# Altium project PCB_DONGHO-_LED_Nguyen_Tuan_Phong.PrjPcb
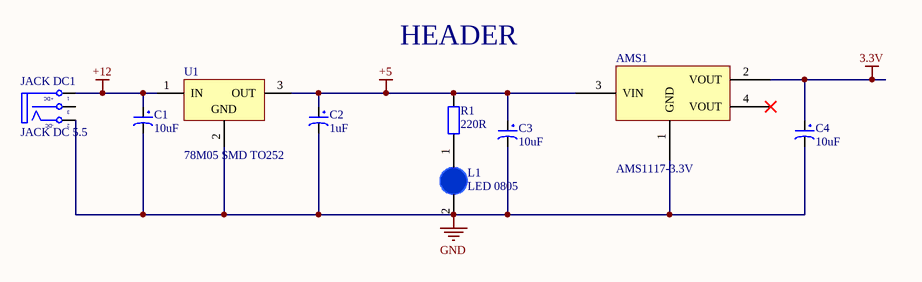
[diagram p0: HEADRE.SchDoc]
5 sheets, 70 parts. Net scope: flat (ports and power ports of the same name join across sheets).
Board file: PCB_DONGHO.PcbDoc
Sheets:
  HEADRE.SchDoc
  ESP8266.SchDoc
  LED 7 THANH.SchDoc
  DS3231.SchDoc
  SCH_DONGHO.SchDoc

## Sheet HEADRE.SchDoc
size A3; SheetNumber: 1; SheetTotal: 5

### Parts
AMS1  AMS1117-3.3V  [SOT223]
C1  10uF  [tu tantalum smd3216]
C2  1uF  [tu tantalum smd3216]
C3  10uF  [tu tantalum smd3216]
C4  10uF  [tu tantalum smd3216]
JACK_DC1  JACK DC 5.5  [JACK DC 5.5]
L1  LED 0805  [LED-0805-Blue]
R1  220R  [tro smd 0603]
U1  78M05 SMD TO252  [TO252]

### Nets
3.3V: AMS1.2(VOUT) C4.1
+5: AMS1.3(VIN) C2.1 C3.1 R1.2 U1.3(OUT)
+12: C1.1 JACK_DC1.1(T) U1.1(IN)
GND: AMS1.1(GND) C1.2 C2.2 C3.2 C4.2 JACK_DC1.2(TN) L1.2(K) U1.2(GND)
NetL1_1: L1.1(A) R1.1

Not connected (* = marked no-connect by the designer): AMS1 4(VOUT)*; JACK_DC1 3(S)

### Notes on the sheet
- HEADER
- (in symbol JACK DC 5.5) +DC; -DC

### Library data of the parts
AMS1 = AMS1117 SMD: Dán; Value: AMS1117-3.3V SOT223; Don_Vi: Con; Ma_Hang: MH000596; Ghi_Chu: *; Kieu_Chan: *; Chung_Loai: Dán
C1 C3 C4 = Tu tantalum 10uF 16V SMD3216: Dán; Don_Vi: Con; So_Chan: 2; Ten_Linh_Kien: Tụ tantalum 106C-10uF 16V SMD3216; Ma_Hang: MH001954; Chung_Loai: Dán; Kieu_Chan: *
C2 = Tu tantalum 1uF 25V SMD3216: Dán; Don_Vi: Con; So_Chan: 2; Ten_Linh_Kien: Tụ tantalum 105E-1uF 25V SMD3216; Ma_Hang: MH007472; Chung_Loai: Dán; Kieu_Chan: *
JACK_DC1 = JACK DC 5.5: Value: Jac DC
L1 = LED 0805 Xanh Duong: Dán; Don_Vi: Con; Ma_Hang: MH002327; Ten_Linh_Kien: LED 0805 Màu Xanh Dương (Blue); Ghi_Chu: *; Kieu_Chan: *; Chung_Loai: Dán
R1 = Tro 0603 5% 220R: Dán; Don_Vi: Con; So_Chan: 2; Ten_Linh_Kien: Trở 0603 5% 220R; Ma_Hang: MH006322; Chung_Loai: Dán; Kieu_Chan: *
U1 = 78M05 SMD TO252: Dán; Don_Vi: Con; Ten_Linh_Kien: 78M05 TO252; Ma_Hang: MH001917; Ghi_Chu: *; Kieu_Chan: *; Chung_Loai: Dán

## Sheet ESP8266.SchDoc
size A3; SheetNumber: 2; SheetTotal: 5
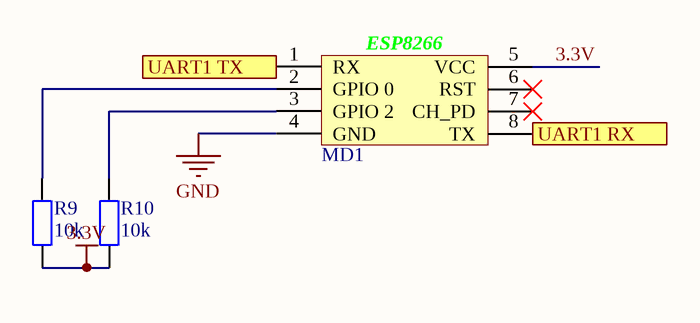
[diagram p1: ESP8266.SchDoc]

### Parts
MD1  ESP8266 Module  [ESP2866 Module]  (value not drawn)
R9  10k  [tro smd 0805]
R10  10k  [tro smd 0805]

### Ports
UART1 RX, UART1 TX

### Nets
3.3V: MD1.5(VCC) R9.1 R10.1
GND: MD1.4(GND)
NetMD1_1: MD1.1(RX) ; port UART1 TX
NetMD1_2: MD1.2(GPIO_0) R9.2
NetMD1_3: MD1.3(GPIO_2) R10.2
NetMD1_8: MD1.8(TX) ; port UART1 RX

Not connected (* = marked no-connect by the designer): MD1 6(RST)* 7(CH_PD)*

### Notes on the sheet
- (in symbol ESP8266 Module) ESP8266

### Library data of the parts
R9 R10 = Tro 0805 5% 10k: Dán; Don_Vi: Con; So_Chan: 2; Ten_Linh_Kien: Trở 0805 5% 10k; Ma_Hang: MH005239; Chung_Loai: Dán; Kieu_Chan: *

## Sheet LED 7 THANH.SchDoc
size A3; SheetNumber: 2; SheetTotal: 5
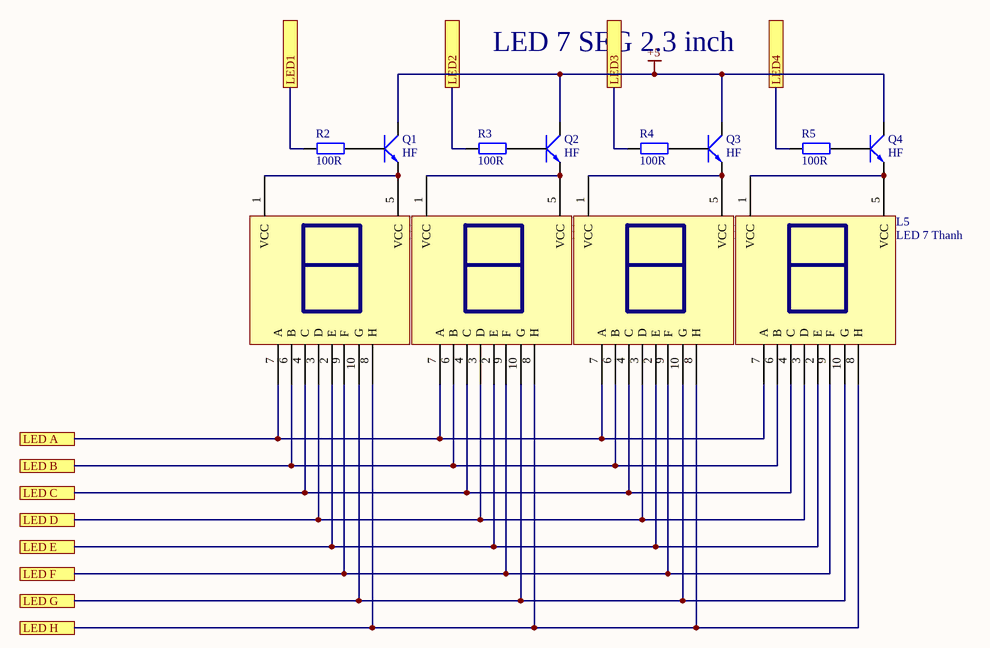
[diagram p2: LED 7 THANH.SchDoc]

### Parts
L2  LED 7 Thanh  [LED7SEG_2.3inch]
L3  LED 7 Thanh  [LED7SEG_2.3inch]
L4  LED 7 Thanh  [LED7SEG_2.3inch]
L5  LED 7 Thanh  [LED7SEG_2.3inch]
Q1  HF  [SOT23]
Q2  HF  [SOT23]
Q3  HF  [SOT23]
Q4  HF  [SOT23]
R2  100R  [tro smd 0805]
R3  100R  [tro smd 0805]
R4  100R  [tro smd 0805]
R5  100R  [tro smd 0805]

### Ports
LED1, LED2, LED3, LED4, LED A, LED B, LED C, LED D, LED E, LED F, LED G, LED H

### Nets
+5: Q1.3(C) Q2.3(C) Q3.3(C) Q4.3(C)
NetL2_1: L2.1(VCC) L2.5(VCC) Q1.2(E)
NetL2_2: L2.2(E) L3.2(E) L4.2(E) L5.2(E) ; port LED E
NetL2_3: L2.3(D) L3.3(D) L4.3(D) L5.3(D) ; port LED D
NetL2_4: L2.4(C) L3.4(C) L4.4(C) L5.4(C) ; port LED C
NetL2_6: L2.6(B) L3.6(B) L4.6(B) L5.6(B) ; port LED B
NetL2_7: L2.7(A) L3.7(A) L4.7(A) L5.7(A) ; port LED A
NetL2_8: L2.8(H) L3.8(H) L4.8(H) L5.8(H) ; port LED H
NetL2_9: L2.9(F) L3.9(F) L4.9(F) L5.9(F) ; port LED F
NetL2_10: L2.10(G) L3.10(G) L4.10(G) L5.10(G) ; port LED G
NetL3_1: L3.1(VCC) L3.5(VCC) Q2.2(E)
NetL4_1: L4.1(VCC) L4.5(VCC) Q3.2(E)
NetL5_1: L5.1(VCC) L5.5(VCC) Q4.2(E)
NetQ1_1: Q1.1(B) R2.2
NetQ2_1: Q2.1(B) R3.2
NetQ3_1: Q3.1(B) R4.2
NetQ4_1: Q4.1(B) R5.2
NetR2_1: R2.1 ; port LED1
NetR3_1: R3.1 ; port LED2
NetR4_1: R4.1 ; port LED3
NetR5_1: R5.1 ; port LED4

### Notes on the sheet
- LED 7 SEG 2.3 inch

### Library data of the parts
L2-L5 = LED 7x1 2.3inch Anot: Dán; Don_Vi: Con; Ma_Hang: MH000901; Ten_Linh_Kien: Led 7 2.3 1 Số Anot (Sáng Đỏ); Ghi_Chu: *; Kieu_Chan: *; Chung_Loai: Dán
Q1-Q4 = C1815 HF SMD: NPN transistor; Value: C9014
R2-R5 = Tro 0805 5% 100R: Dán; Don_Vi: Con; So_Chan: 2; Ten_Linh_Kien: Trở 0805 5% 100R; Ma_Hang: MH005251; Chung_Loai: Dán; Kieu_Chan: *

## Sheet DS3231.SchDoc
size A3; SheetNumber: 3; SheetTotal: 5
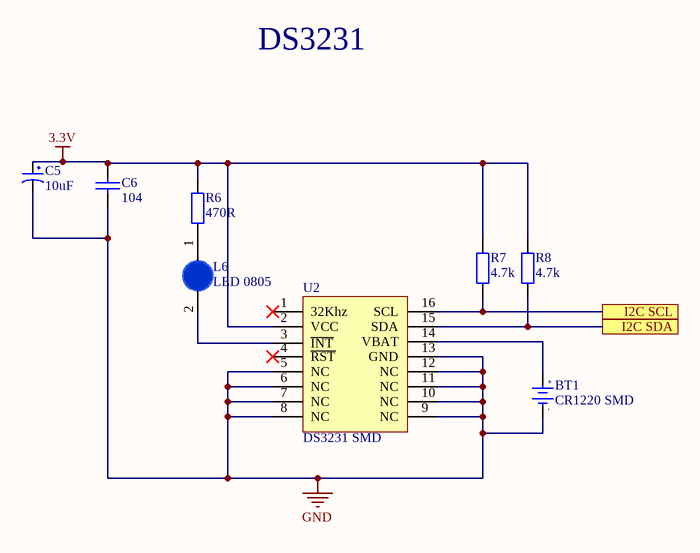
[diagram p3: DS3231.SchDoc]

### Parts
BT1  CR1220 SMD  [DE PIN CR1220]
C5  10uF  [tu tantalum smd3216]
C6  104  [tu 0805]
L6  LED 0805  [LED-0805-Blue]
R6  470R  [Tro SMD 0805]
R7  4.7k  [tro smd 0805]
R8  4.7k  [tro smd 0805]
U2  DS3231 SMD  [SOIC 16]

### Ports
I2C SCL, I2C SDA

### Nets
3.3V: C5.1 C6.1 R6.2 R7.2 R8.2 U2.2(VCC)
GND: BT1.2(GND) C5.2 C6.2 U2.5(NC) U2.6(NC) U2.7(NC) U2.8(NC) U2.9(NC) U2.10(NC) U2.11(NC) U2.12(NC) U2.13(GND)
NetBT1_1: BT1.1(+3V) U2.14(VBAT)
NetL6_1: L6.1(A) R6.1
NetL6_2: L6.2(K) U2.3(~{INT})
NetR7_1: R7.1 U2.16(SCL) ; port I2C SCL
NetR8_1: R8.1 U2.15(SDA) ; port I2C SDA

Not connected (* = marked no-connect by the designer): U2 1(32Khz)* 4(~{RST})*

### Notes on the sheet
- DS3231
- (in symbol De pin CR1220 SMD) +; -

### Library data of the parts
BT1 = De pin CR1220 SMD: Ten: Đế PIN CR1220 SMD; Ma_Hang: MH000833
C5 = Tu tantalum 10uF 16V SMD3216: as C1 on sheet HEADRE; Chung_Loai: Dán; Kieu_Chan: *
C6 = Tu 0805 104 50V 10%: Dán; Don_Vi: Con; So_Chan: 2; Ten_Linh_Kien: Tụ 0805 104-100nF 10% 50V; Ma_Hang: MH004551; Chung_Loai: Dán; Kieu_Chan: *
L6 = LED 0805 Xanh Duong: as L1 on sheet HEADRE; Ghi_Chu: *; Kieu_Chan: *; Chung_Loai: Dán
R6 = Tro 0805 5% 470R: Dán; Don_Vi: Con; Ma_Hang: MH005341; Ten_Linh_Kien: Trở 0805 5% 470R; So_Chan: 2; Chung_Loai: Dán; Kieu_Chan: *
R7 R8 = Tro 0805 5% 4.7k: Dán; Don_Vi: Con; So_Chan: 2; Ten_Linh_Kien: Trở 0805 5% 4.7k; Ma_Hang: MH005307; Chung_Loai: Dán; Kieu_Chan: *
U2 = DS3231 SMD: SOIC

## Sheet SCH_DONGHO.SchDoc
size A3; SheetNumber: 5; SheetTotal: 5
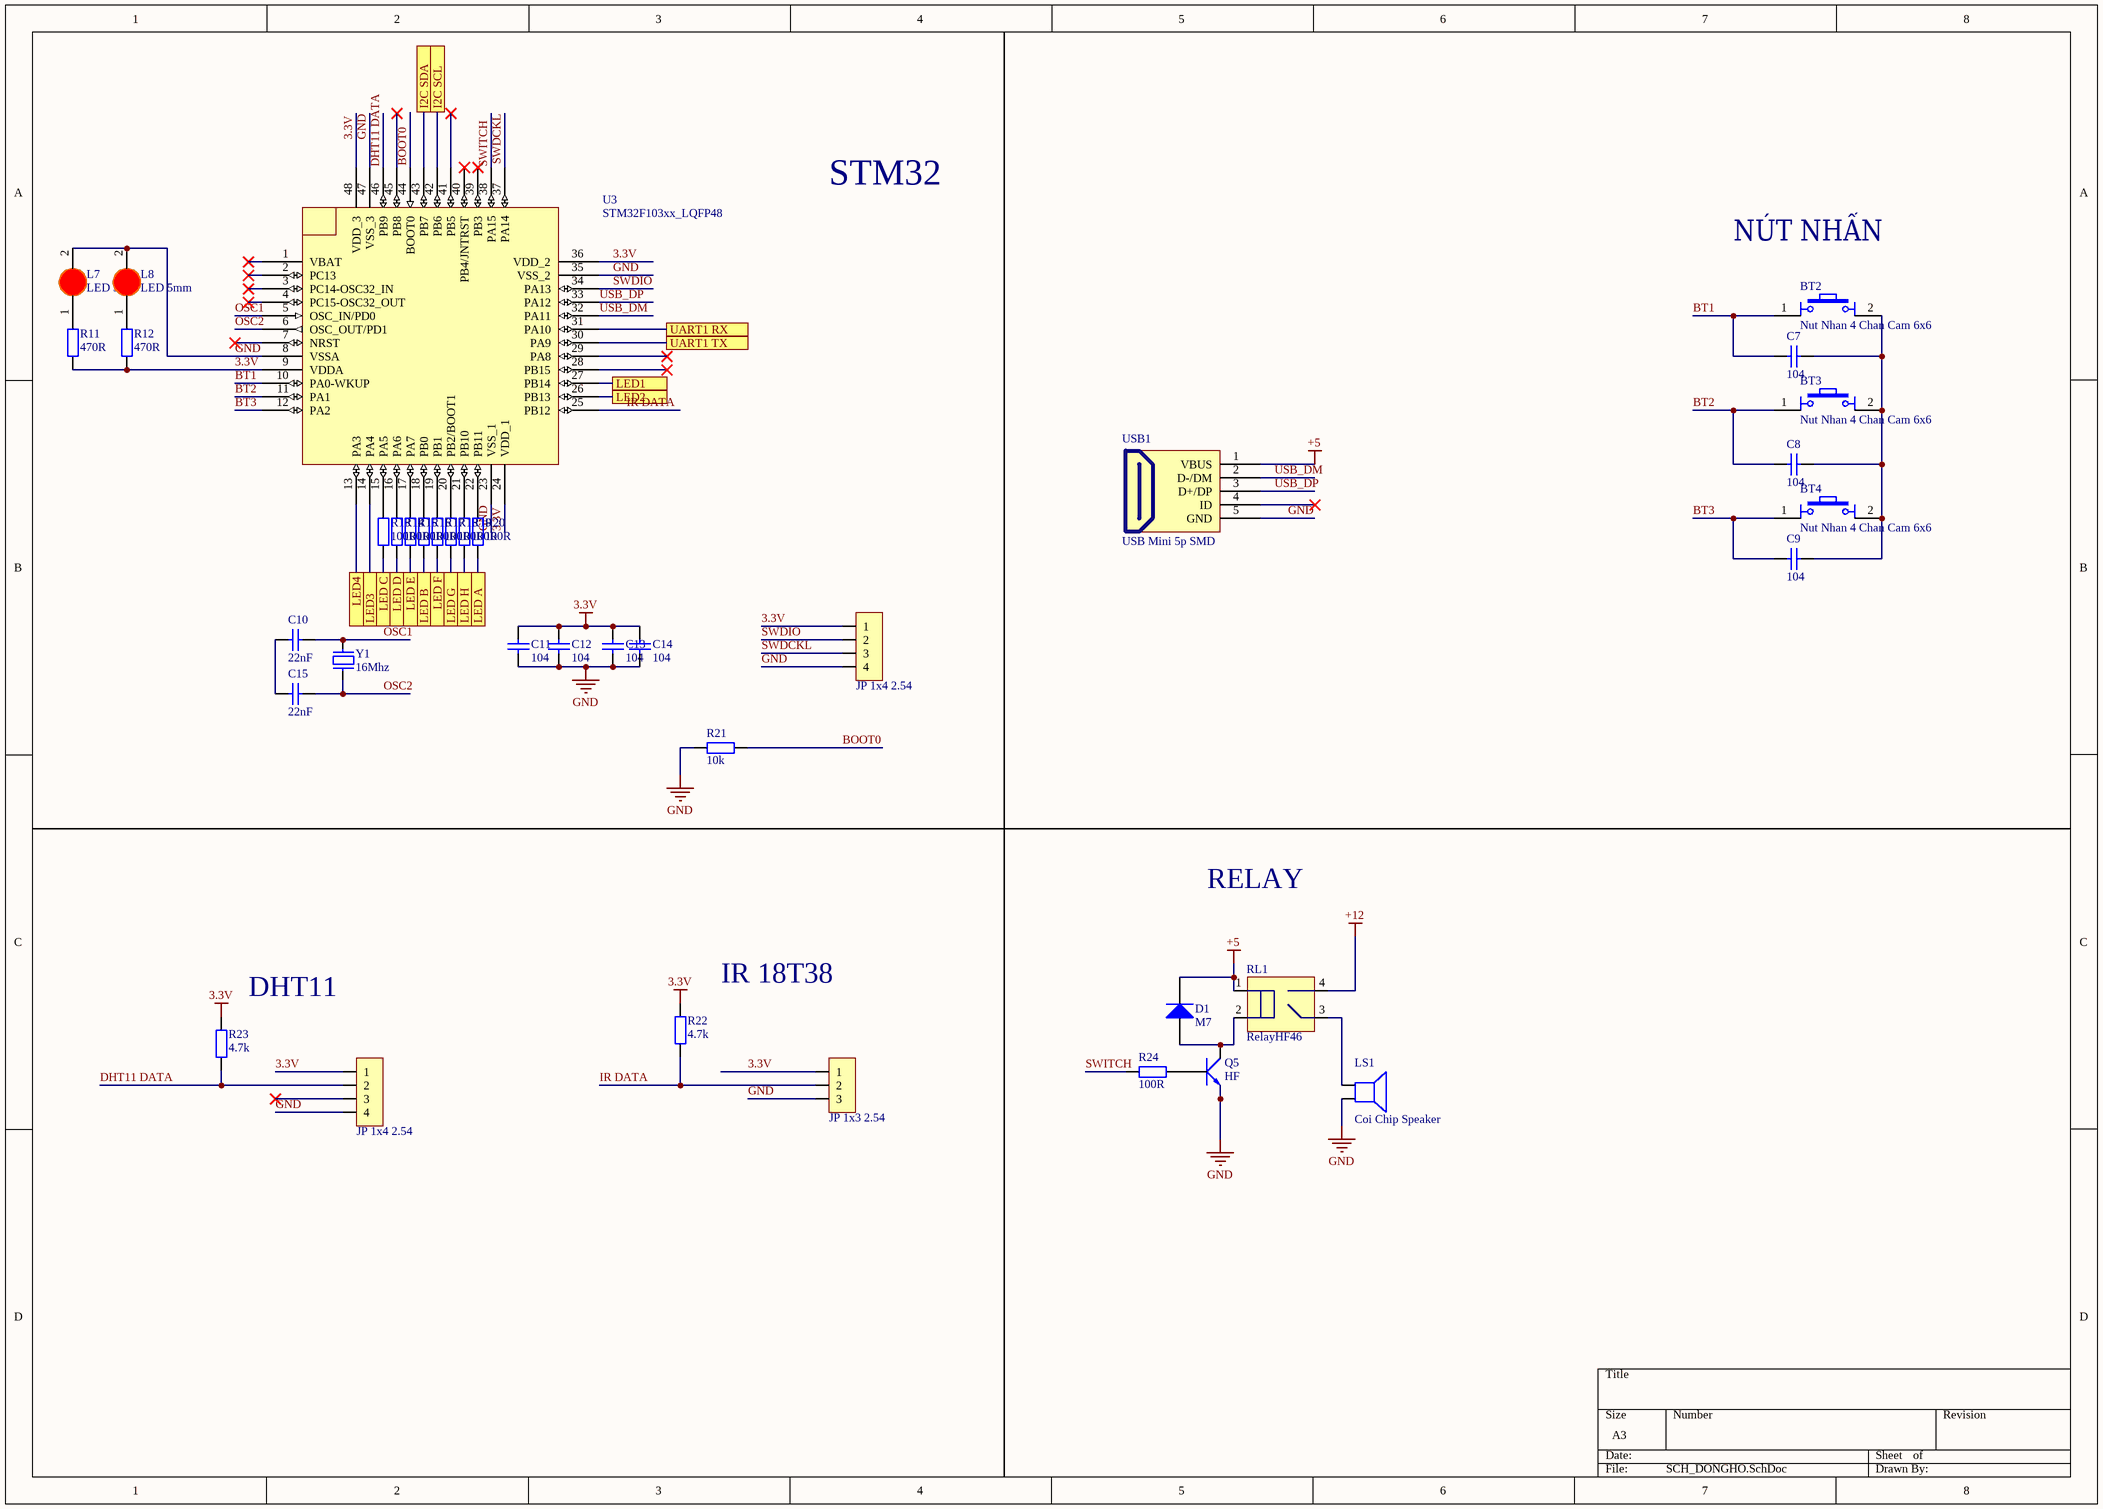
[diagram p4: SCH_DONGHO.SchDoc]

### Parts
BT2  Nut Nhan 4 Chan Cam 6x6  [Nut Nhan 4 Chan Cam 6x6]
BT3  Nut Nhan 4 Chan Cam 6x6  [Nut Nhan 4 Chan Cam 6x6]
BT4  Nut Nhan 4 Chan Cam 6x6  [Nut Nhan 4 Chan Cam 6x6]
C7  104  [tu 0805]
C8  104  [tu 0805]
C9  104  [tu 0805]
C10  22nF  [tu 0805]
C11  104  [tu 0805]
C12  104  [tu 0805]
C13  104  [tu 0805]
C14  104  [tu 0805]
C15  22nF  [tu 0805]
D1  M7  [DIODE SMA]
JP1  JP 1x4 2.54  [JP 1x4 CT]
JP2  JP 1x4 2.54  [JP 1x4 CT]
JP3  JP 1x3 2.54  [JP 1x3 CT]
L7  LED 5mm  [LED-5MM-RED]
L8  LED 5mm  [LED-5MM-RED]
LS1  Coi Chip Speaker  [Coi Chip Speacker]
Q5  HF  [SOT23]
R11  470R  [Tro SMD 0805]
R12  470R  [Tro SMD 0805]
R13  100R  [tro smd 0805]
R14  100R  [tro smd 0805]
R15  100R  [tro smd 0805]
R16  100R  [tro smd 0805]
R17  100R  [tro smd 0805]
R18  100R  [tro smd 0805]
R19  100R  [tro smd 0805]
R20  100R  [tro smd 0805]
R21  10k  [tro smd 0805]
R22  4.7k  [tro smd 0805]
R23  4.7k  [tro smd 0805]
R24  100R  [tro smd 0805]
RL1  RelayHF46  [Relay 4 chan HF46F]
U3  STM32F103xx_LQFP48  [STM32_LQPF48]
USB1  USB Mini 5p SMD  [USB Mini 5p SMD]
Y1  16Mhz  [Thach Anh 2 chan SMD]

### Ports
I2C SCL, I2C SDA, LED1, LED2, LED3, LED4, LED A, LED B, LED C, LED D, LED E, LED F, LED G, LED H, UART1 RX, UART1 TX

### Nets
3.3V: C11.1 C12.1 C13.1 C14.1 JP1.1 JP2.1 JP3.1 R11.1 R12.1 R22.2 R23.2 U3.9(VDDA) U3.24(VDD_1) U3.36(VDD_2) U3.48(VDD_3)
+5: D1.2(K) RL1.1 USB1.1(VBUS)
+12: RL1.4(AC/DC)
GND: C11.2 C12.2 C13.2 C14.2 JP1.4 JP2.4 JP3.3 L7.2(K) L8.2(K) LS1.2 Q5.2(E) R21.2 U3.8(VSSA) U3.23(VSS_1) U3.35(VSS_2) U3.47(VSS_3) USB1.5(GND)
BOOT0: R21.1 U3.44(BOOT0)
BT1: BT2.1 C7.2 U3.10(PA0-WKUP)
BT2: BT3.1 C8.2 U3.11(PA1)
BT3: BT4.1 C9.2 U3.12(PA2)
DHT11 DATA: JP2.2 R23.1 U3.46(PB9)
IR DATA: JP3.2 R22.1 U3.25(PB12)
OSC1: C10.1 U3.5(OSC_IN/PD0) Y1.2
OSC2: C15.1 U3.6(OSC_OUT/PD1) Y1.1
SWDCKL: JP1.3 U3.37(PA14)
SWDIO: JP1.2 U3.34(PA13)
SWITCH: R24.1 U3.38(PA15)
USB_DM: U3.32(PA11) USB1.2(D-/DM)
USB_DP: U3.33(PA12) USB1.3(D+/DP)
NetBT2_2: BT2.2 BT3.2 BT4.2 C7.1 C8.1 C9.1
NetC10_2: C10.2 C15.2
NetD1_1: D1.1(A) Q5.3(C) RL1.2
NetL2_2: R15.1 ; port LED E
NetL2_3: R14.1 ; port LED D
NetL2_4: R13.1 ; port LED C
NetL2_6: R16.2 ; port LED B
NetL2_7: R20.2 ; port LED A
NetL2_8: R19.2 ; port LED H
NetL2_9: R17.1 ; port LED F
NetL2_10: R18.2 ; port LED G
NetL7_1: L7.1(A) R11.2
NetL8_1: L8.1(A) R12.2
NetLS1_1: LS1.1 RL1.3(AC/DC)
NetMD1_1: U3.30(PA9) ; port UART1 TX
NetMD1_8: U3.31(PA10) ; port UART1 RX
NetQ5_1: Q5.1(B) R24.2
NetR2_1: U3.27(PB14) ; port LED1
NetR3_1: U3.26(PB13) ; port LED2
NetR4_1: U3.14(PA4) ; port LED3
NetR5_1: U3.13(PA3) ; port LED4
NetR7_1: U3.42(PB6) ; port I2C SCL
NetR8_1: U3.43(PB7) ; port I2C SDA
NetR13_2: R13.2 U3.15(PA5)
NetR14_2: R14.2 U3.16(PA6)
NetR15_2: R15.2 U3.17(PA7)
NetR16_1: R16.1 U3.18(PB0)
NetR17_2: R17.2 U3.19(PB1)
NetR18_1: R18.1 U3.20(PB2/BOOT1)
NetR19_1: R19.1 U3.21(PB10)
NetR20_1: R20.1 U3.22(PB11)

Not connected (* = marked no-connect by the designer): JP2 3*; U3 1(VBAT)* 2(PC13)* 3(PC14-OSC32_IN)* 4(PC15-OSC32_OUT)* 7(NRST)* 28(PB15)* 29(PA8)* 39(PB3)* 40(PB4/JNTRST)* 41(PB5)* 45(PB8)*; USB1 4(ID)*

### Notes on the sheet
- STM32
- NÚT NHẤN
- RELAY
- (near R22) IR 18T38
- (near R23) DHT11

### Library data of the parts
BT2-BT4 = Nut Nhan 4 Chan Cam 6x6: Nut Nhan 4 Chan 6x6mm; Ten: Nút Nhấn 4 Chân 6x6x5MM DIP; Ma_Hang: MH004584
C7-C9 C11-C14 = Tu 0805 104 50V 10%: as C6 on sheet DS3231; Chung_Loai: Dán; Kieu_Chan: *
C10 C15 = Tu 0805 22nF 50V 20%: Dán; Don_Vi: Con; So_Chan: 2; Ten_Linh_Kien: Tụ 0805 22nF 50V 20%; Ma_Hang: MH007857; Chung_Loai: Dán; Kieu_Chan: *
D1 = Diode M7 ( 4007 ): Dán; Don_Vi: Con; Ten_Linh_Kien: Diode M7 1N4007 SMD 1A 1000V; Ma_Hang: MH000944; Chung_Loai: Dán; Ghi_Chu: *
JP1 JP2 = JP 1x4 2.54 Cai Thang: Cắm; Ten_Linh_Kien: Jump Đơn Cái 2.54MM 1x20P Thẳng; Don_Vi: Con; Ma_Hang: MH004006; Ghi_Chu: *; Kieu_Chan: *; Chung_Loai: Cắm
JP3 = JP 1x3 2.54 Cai Thang: Cắm; Ten_Linh_Kien: Jump Đơn Cái 2.54MM 1x20P Thẳng; Don_Vi: Con; Ma_Hang: MH004006; Ghi_Chu: *; Kieu_Chan: *; Chung_Loai: Cắm
L7 L8 = LED 5mm Do: Cắm; Don_Vi: Con; Ma_Hang: MH008967; Ten_Linh_Kien: Led 5MM Phủ Đỏ (1000c); Ghi_Chu: *; Kieu_Chan: *; Chung_Loai: Cắm
LS1 = Coi Chip Speaker: Còi chip
Q5 = C1815 HF SMD: NPN transistor; Value: C9014
R11 R12 = Tro 0805 5% 470R: as R6 on sheet DS3231; Chung_Loai: Dán; Kieu_Chan: *
R13-R20 R24 = Tro 0805 5% 100R: as R2 on sheet LED 7 THANH; Chung_Loai: Dán; Kieu_Chan: *
R21 = Tro 0805 5% 10k: as R9 on sheet ESP8266; Chung_Loai: Dán; Kieu_Chan: *
R22 R23 = Tro 0805 5% 4.7k: as R7 on sheet DS3231; Chung_Loai: Dán; Kieu_Chan: *
RL1 = Relay 4 chan HF46F: Ten: Relay 5V5A HF46F-G 5-HS1; Ma_Hang: MH003879
USB1 = USB Mini 5p SMD: USB Type B; Ten: MiniUSB 5P SMD; Ma_Hang: MH001022
Y1 = Thach Anh 2 chan SMD: Crystal For all Crystal 2pin.; Value: 4Mhz
U3 = STM32F103xx_LQFP48: Published: 30-May-2008; DatasheetVersion: rev6, Mar-2008; PackageVersion: Mar-2008; PackageReference: LQFP48; Publisher: Altium Limited; PackageDescription: 48-Pin Low-Profile Quad Flat Pack, 7 x 7 mm Body, 0.5 mm Pitch (LQFP48); ComponentLink1Description: Manufacturer Link; ComponentLink1URL: www.st.com/stm32; ComponentLink2Description: Datasheet; ComponentLink2URL: http://www.st.com/stonline/products/literature/ds/13587.pdf

## Nets that join several sheets
3.3V: HEADRE (AMS1.2 C4.1), ESP8266 (MD1.5 R9.1 R10.1), DS3231 (6 pins), SCH_DONGHO (15 pins)
+5: HEADRE (5 pins), LED 7 THANH (Q1.3 Q2.3 Q3.3 Q4.3), SCH_DONGHO (D1.2 RL1.1 USB1.1)
+12: HEADRE (C1.1 JACK_DC1.1 U1.1), SCH_DONGHO (RL1.4)
GND: HEADRE (8 pins), ESP8266 (MD1.4), DS3231 (12 pins), SCH_DONGHO (17 pins)
NetL2_2: LED 7 THANH (L2.2 L3.2 L4.2 L5.2), SCH_DONGHO (R15.1)
NetL2_3: LED 7 THANH (L2.3 L3.3 L4.3 L5.3), SCH_DONGHO (R14.1)
NetL2_4: LED 7 THANH (L2.4 L3.4 L4.4 L5.4), SCH_DONGHO (R13.1)
NetL2_6: LED 7 THANH (L2.6 L3.6 L4.6 L5.6), SCH_DONGHO (R16.2)
NetL2_7: LED 7 THANH (L2.7 L3.7 L4.7 L5.7), SCH_DONGHO (R20.2)
NetL2_8: LED 7 THANH (L2.8 L3.8 L4.8 L5.8), SCH_DONGHO (R19.2)
NetL2_9: LED 7 THANH (L2.9 L3.9 L4.9 L5.9), SCH_DONGHO (R17.1)
NetL2_10: LED 7 THANH (L2.10 L3.10 L4.10 L5.10), SCH_DONGHO (R18.2)
NetMD1_1: ESP8266 (MD1.1), SCH_DONGHO (U3.30)
NetMD1_8: ESP8266 (MD1.8), SCH_DONGHO (U3.31)
NetR2_1: LED 7 THANH (R2.1), SCH_DONGHO (U3.27)
NetR3_1: LED 7 THANH (R3.1), SCH_DONGHO (U3.26)
NetR4_1: LED 7 THANH (R4.1), SCH_DONGHO (U3.14)
NetR5_1: LED 7 THANH (R5.1), SCH_DONGHO (U3.13)
NetR7_1: DS3231 (R7.1 U2.16), SCH_DONGHO (U3.42)
NetR8_1: DS3231 (R8.1 U2.15), SCH_DONGHO (U3.43)